# Altium schematic sheet LED_EN_Kian_V2_CONECTOR.SchDoc
size A
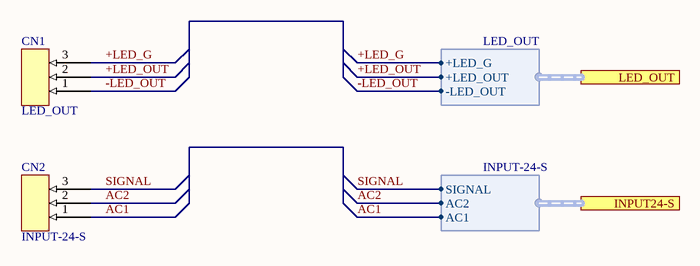
[diagram p0: LED_EN_Kian_V2_CONECTOR.SchDoc]

## Parts
CN1  LED_OUT  [CONECTOR/FONIX/3PIN]
CN2  INPUT-24-S  [CONECTOR/FONIX/3PIN]

## Ports
INPUT24-S (harness INPUT-24-S), LED_OUT (harness LED_OUT)

## Harnesses
LED_OUT: +LED_G, +LED_OUT, -LED_OUT
INPUT-24-S: SIGNAL, AC2, AC1

## Nets
+LED_G: CN1.3 ; port LED_OUT.+LED_G
+LED_OUT: CN1.2 ; port LED_OUT.+LED_OUT
-LED_OUT: CN1.1 ; port LED_OUT.-LED_OUT
AC1: CN2.1 ; port INPUT24-S.AC1
AC2: CN2.2 ; port INPUT24-S.AC2
SIGNAL: CN2.3 ; port INPUT24-S.SIGNAL

## Library data of the parts
CN1 CN2 = CONECTOR/FONIX/3PIN